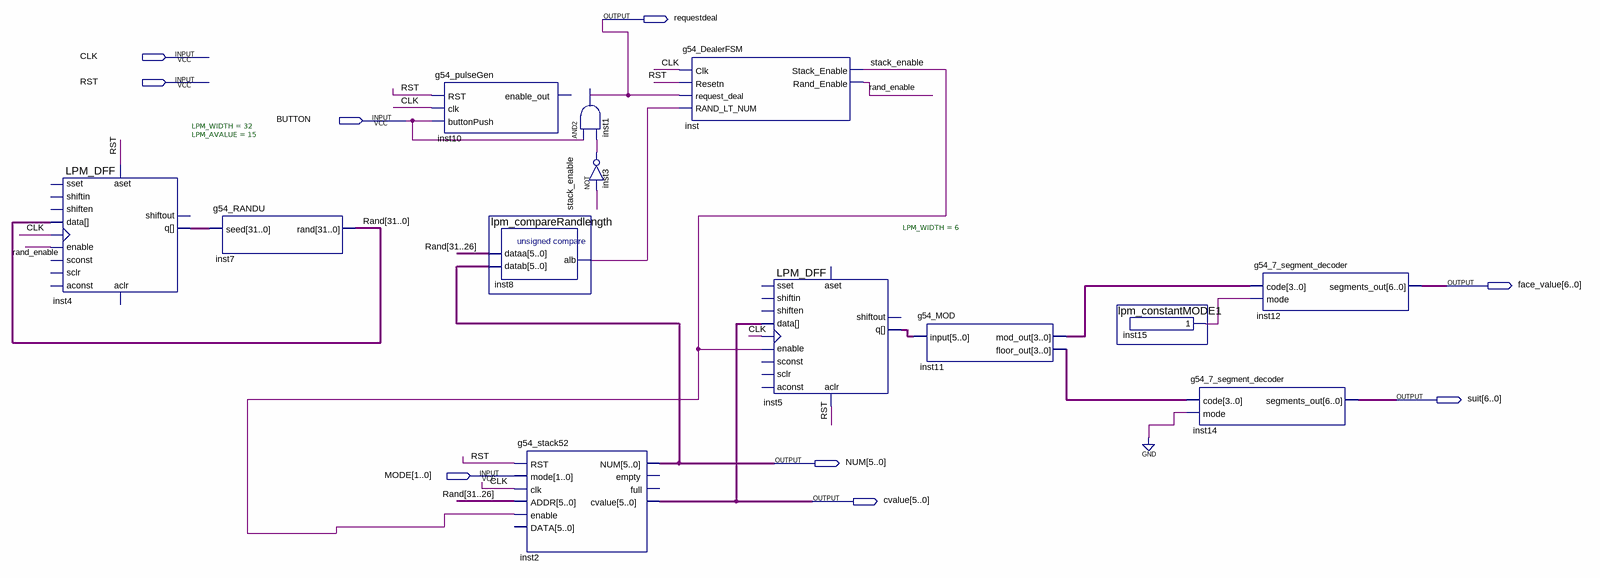
[diagram p0: schematic sheet]
// Quartus schematic g54_Lab4-3_TESTBED.bdf as structural Verilog: 13 symbols, 9 pins
module \g54_Lab4-3_TESTBED  (
  input  CLK,
  input  RST,
  input  BUTTON,
  input  [1:0] MODE,
  output requestdeal,
  output [6:0] face_value,
  output [6:0] suit,
  output [5:0] NUM,
  output [5:0] cvalue
);

  wire inst3_out, inst8_alb, inst15_result, rand_enable, stack_enable;
  wire [3:0] inst11_floor_out, inst11_mod_out;
  wire [5:0] inst5_q;
  wire [31:0] inst4_q, Rand;

  LPM_DFF #(.LPM_WIDTH(32), .LPM_AVALUE(15)) inst4 (
    .enable(rand_enable), .clock(CLK), .data(Rand), .aset(RST), .q(inst4_q));  // open: shiftin, shiften, aconst, sclr, sconst, sset, aclr, shiftout
  g54_RANDU inst7 (.seed(inst4_q), .\rand (Rand));
  g54_pulseGen inst10 (.RST(RST), .clk(CLK), .buttonPush(BUTTON));  // open: enable_out
  lpm_compareRandlength inst8 (.dataa(Rand[31:26]), .datab(NUM), .alb(inst8_alb));
  g54_stack52 inst2 (
    .RST(RST), .mode(MODE), .clk(CLK), .ADDR(Rand[31:26]), .enable(stack_enable), .NUM(NUM), .cvalue(cvalue));  // open: DATA, empty, full
  and inst1 (requestdeal, BUTTON, inst3_out);
  not inst3 (inst3_out, stack_enable);
  g54_DealerFSM inst (
    .Clk(CLK), .Resetn(RST), .request_deal(requestdeal), .RAND_LT_NUM(inst8_alb),
    .Stack_Enable(stack_enable), .Rand_Enable(rand_enable));
  LPM_DFF #(.LPM_WIDTH(6)) inst5 (
    .enable(stack_enable), .clock(CLK), .data(cvalue), .aclr(RST), .q(inst5_q));  // open: shiftin, shiften, aconst, sclr, sconst, sset, aset, shiftout
  g54_MOD inst11 (.\input (inst5_q), .mod_out(inst11_mod_out), .floor_out(inst11_floor_out));
  lpm_constantMODE1 inst15 (.result(inst15_result));
  g54_7_segment_decoder inst14 (.code(inst11_floor_out), .mode(1'b0), .segments_out(suit));
  g54_7_segment_decoder inst12 (.code(inst11_mod_out), .mode(inst15_result), .segments_out(face_value));
endmodule
